# EAGLE schematic backplane (EAGLE 7.6.0)
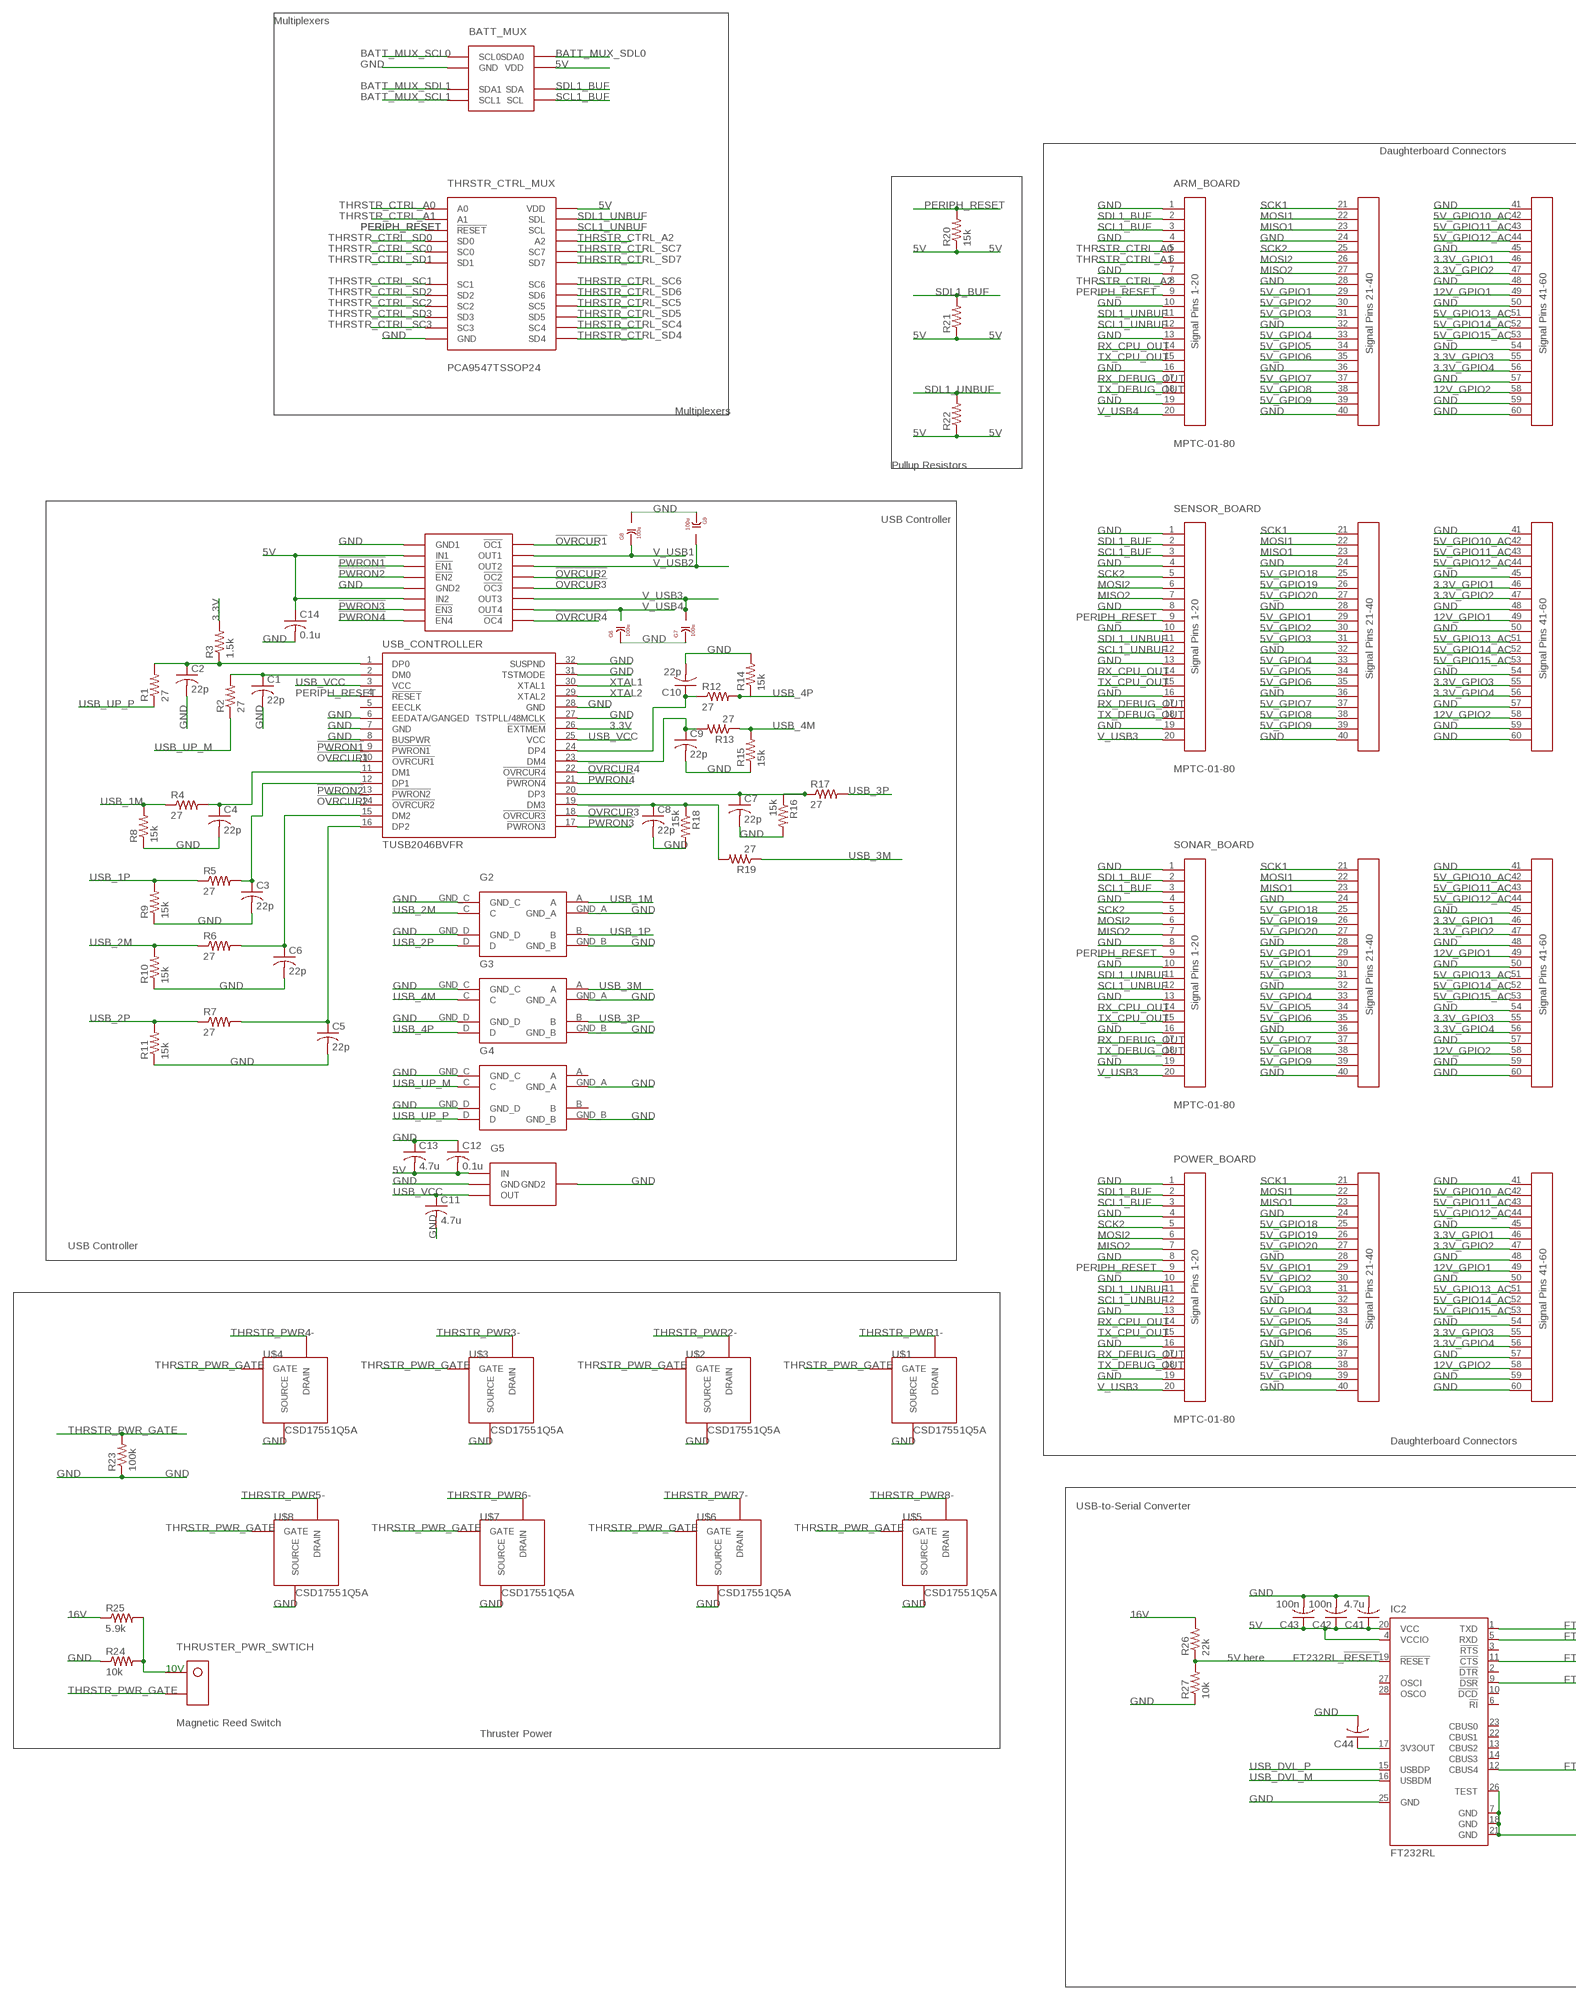
[diagram p0: schematic, sheet 1, part 1 of 2]
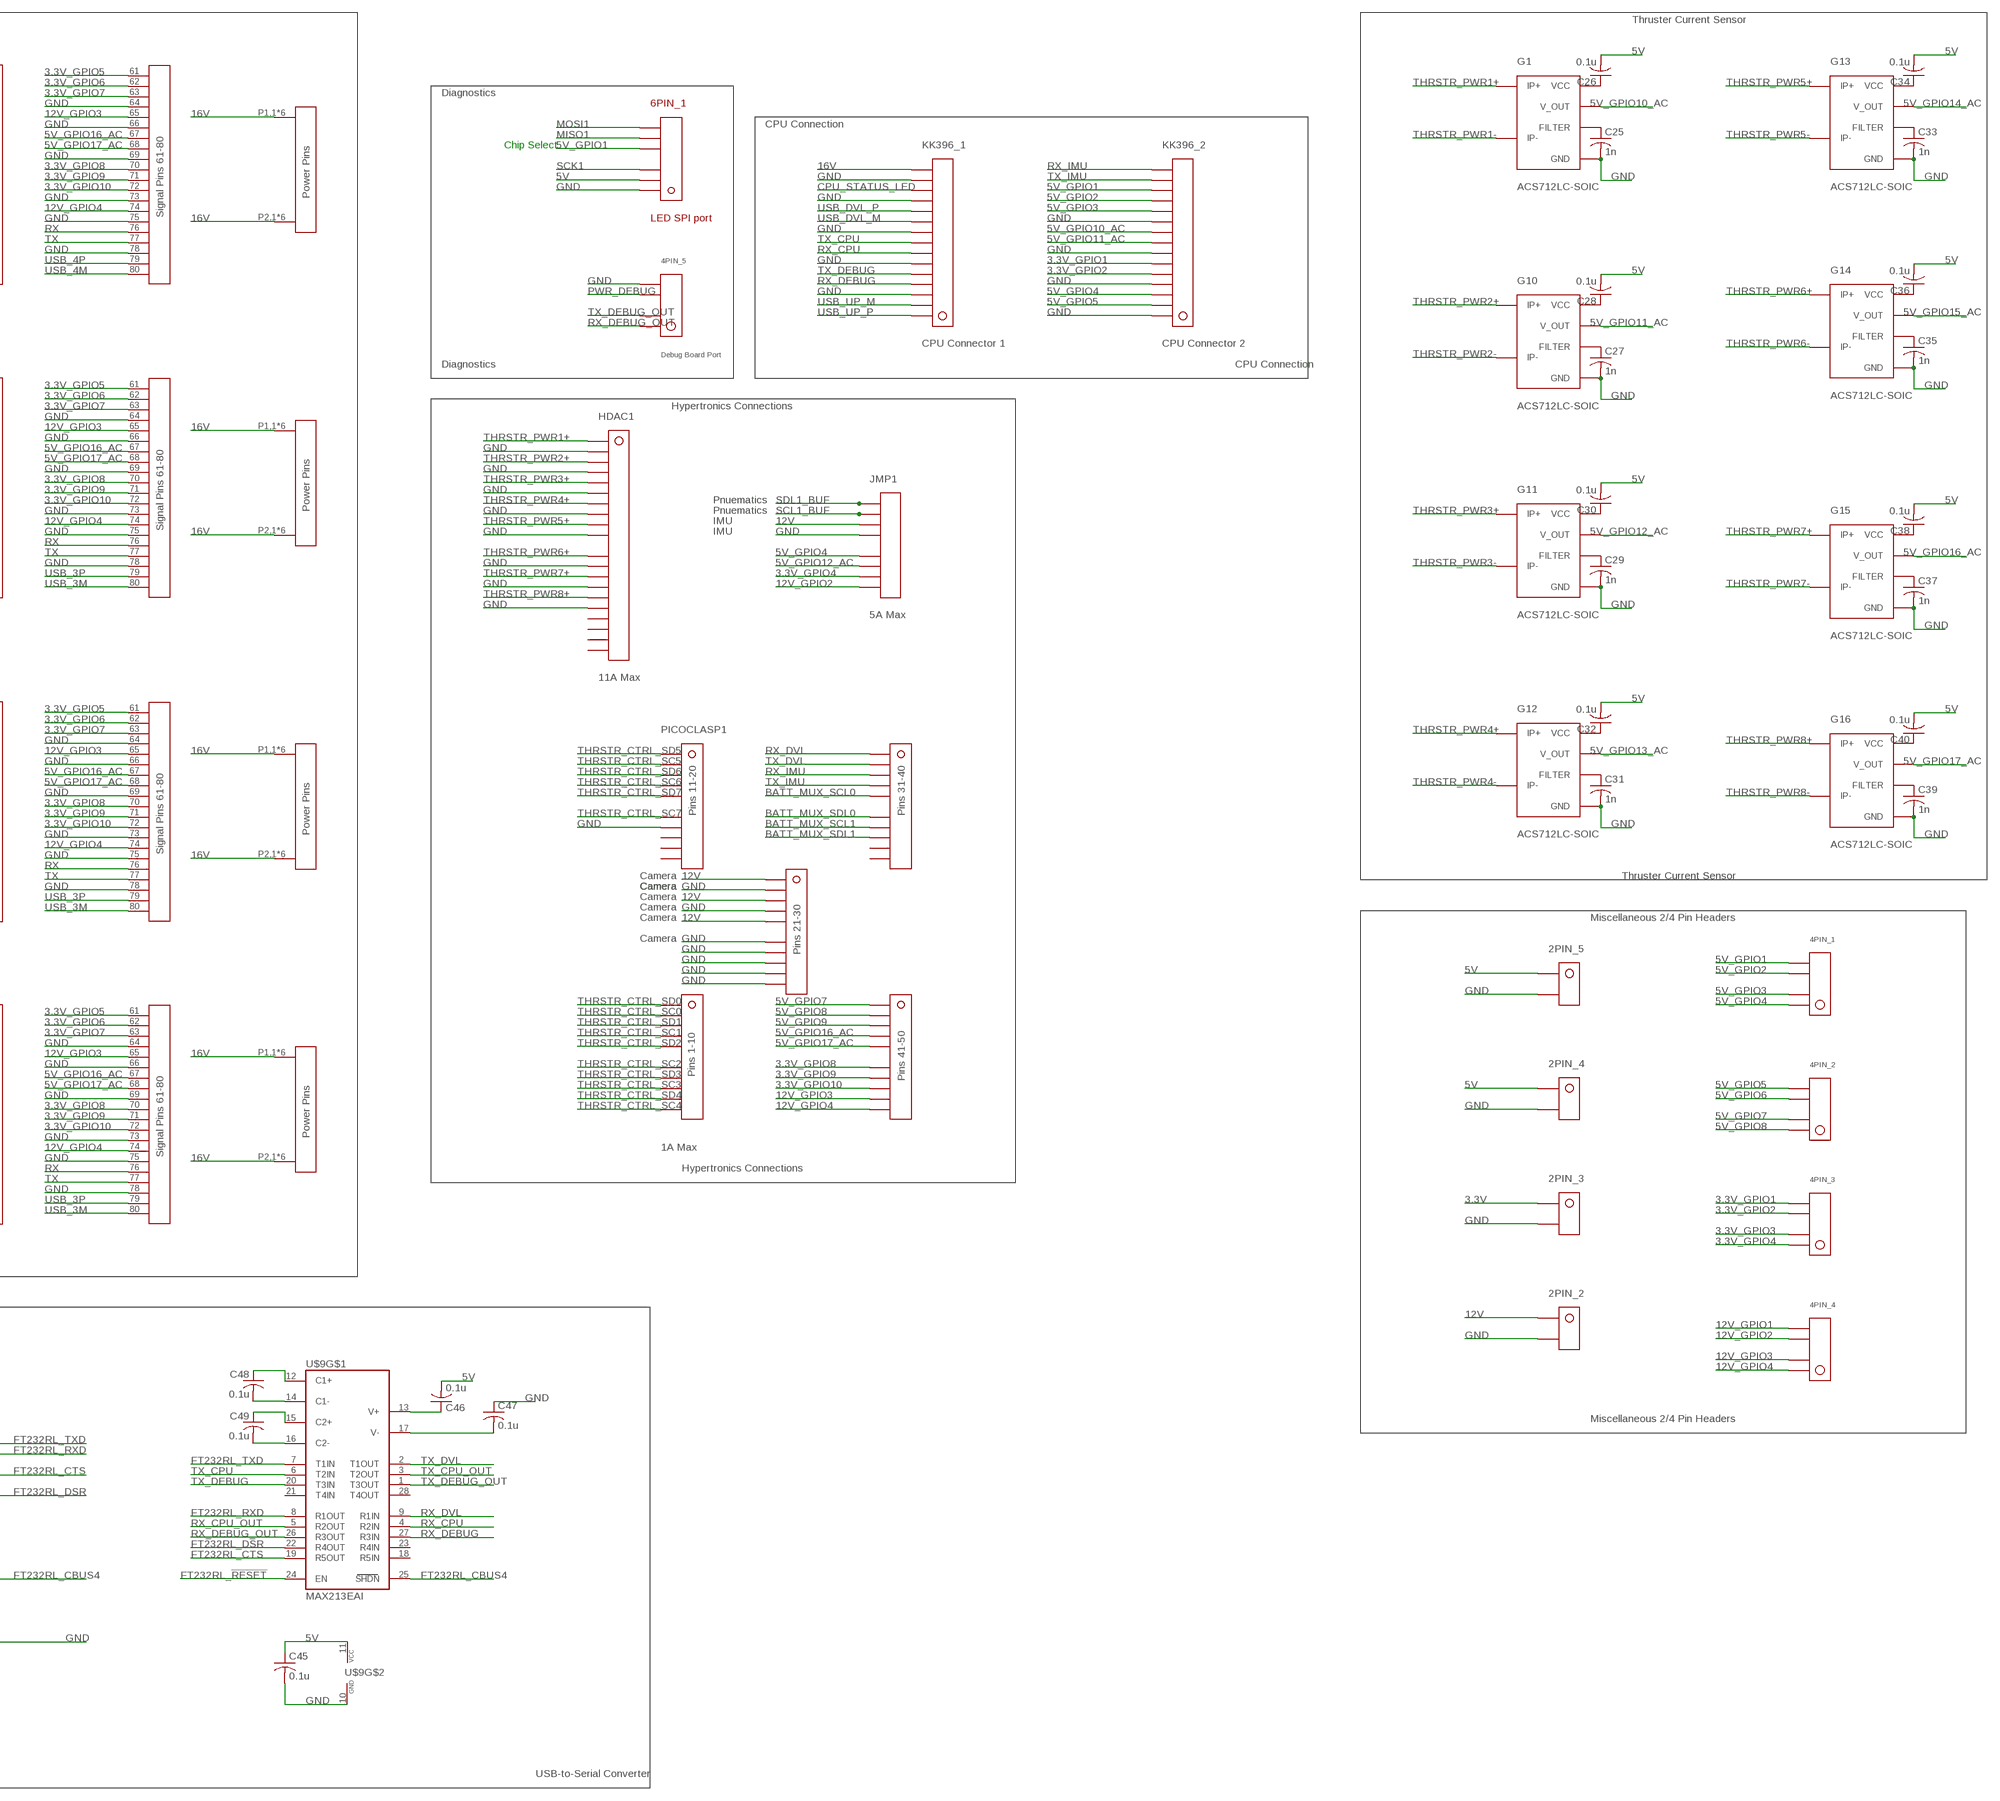
[diagram p1: schematic, sheet 1, part 2 of 2]

## Parts
2PIN_2  KK254_VERT_2PIN22-29-2021  [KK254_VERT_2PIN]
2PIN_3  KK254_VERT_2PIN22-29-2021  [KK254_VERT_2PIN]
2PIN_4  KK254_VERT_2PIN22-29-2021  [KK254_VERT_2PIN]
2PIN_5  KK254_VERT_2PIN22-29-2021  [KK254_VERT_2PIN]
4PIN_1  KK254_VERT_4PIN22-29-2041  [KK254_VERT_4PIN]
4PIN_2  KK254_VERT_4PIN22-29-2041  [KK254_VERT_4PIN]
4PIN_3  KK254_VERT_4PIN22-29-2041  [KK254_VERT_4PIN]
4PIN_4  KK254_VERT_4PIN22-29-2041  [KK254_VERT_4PIN]
4PIN_5  Debug Board Port  KK254_VERT_4PIN22-29-2041  [KK254_VERT_4PIN]
6PIN_1  LED SPI port  KK254_6PIN  [KK254_6PIN]
ARM_BOARD  MPTC-01-80  [MPTC-01-80]
BATT_MUX  PCA9540BTSSOP8  [PCA9540B]
C1  22p  C-USC0603  [C0603]
C2  22p  C-USC0603  [C0603]
C3  22p  C-USC0603  [C0603]
C4  22p  C-USC0603  [C0603]
C5  22p  C-USC0603  [C0603]
C6  22p  C-USC0603  [C0603]
C7  22p  C-USC0603  [C0603]
C8  22p  C-USC0603  [C0603]
C9  22p  C-USC0603  [C0603]
C10  22p  C-USC0603  [C0603]
C11  4.7u  C-USC0603  [C0603]
C12  0.1u  C-USC0603  [C0603]
C13  4.7u  C-USC0603  [C0603]
C14  0.1u  C-USC0603  [C0603]
C25  1n  C-USC0603  [C0603]
C26  0.1u  C-USC0603  [C0603]
C27  1n  C-USC0603  [C0603]
C28  0.1u  C-USC0603  [C0603]
C29  1n  C-USC0603  [C0603]
C30  0.1u  C-USC0603  [C0603]
C31  1n  C-USC0603  [C0603]
C32  0.1u  C-USC0603  [C0603]
C33  1n  C-USC0603  [C0603]
C34  0.1u  C-USC0603  [C0603]
C35  1n  C-USC0603  [C0603]
C36  0.1u  C-USC0603  [C0603]
C37  1n  C-USC0603  [C0603]
C38  0.1u  C-USC0603  [C0603]
C39  1n  C-USC0603  [C0603]
C40  0.1u  C-USC0603  [C0603]
C41  4.7u  C-USC0603  [C0603]
C42  100n  C-USC0603  [C0603]
C43  100n  C-USC0603  [C0603]
C44  C-USC0603  [C0603]
C45  0.1u  C-USC0603  [C0603]
C46  0.1u  C-USC0603  [C0603]
C47  0.1u  C-USC0603  [C0603]
C48  0.1u  C-USC0603  [C0603]
C49  0.1u  C-USC0603  [C0603]
G1  ACS712LC-SOIC  [ACS712-SOIC]
G2  SN75240PW'TSSOP  [SN75240PW]
G3  SN75240PW'TSSOP  [SN75240PW]
G4  SN75240PW'TSSOP  [SN75240PW]
G5  LM3940IMP-3.3/NOPB  [SOT223-DCY]
G6  100u  F930J107MBA  [F930J107MBA]
G7  100u  F930J107MBA  [F930J107MBA]
G8  100u  F930J107MBA  [F930J107MBA]
G9  100u  F930J107MBA  [F930J107MBA]
G10  ACS712LC-SOIC  [ACS712-SOIC]
G11  ACS712LC-SOIC  [ACS712-SOIC]
G12  ACS712LC-SOIC  [ACS712-SOIC]
G13  ACS712LC-SOIC  [ACS712-SOIC]
G14  ACS712LC-SOIC  [ACS712-SOIC]
G15  ACS712LC-SOIC  [ACS712-SOIC]
G16  ACS712LC-SOIC  [ACS712-SOIC]
HDAC1  11A Max  HDAC64_VERT_20PIN30700-4122  [HDAC64_VERT_20PIN]
IC2  FT232RL  [SSOP28]
JMP1  5A Max  MICROFIT3_VERT_8PIN43045-0828  [MICROFIT3_VERT_8PIN]
KK396_1  CPU Connector 1  KK396_VERT_15PIN  [KK396_VERT_15PIN]
KK396_2  CPU Connector 2  KK396_VERT_15PIN  [KK396_VERT_15PIN]
PICOCLASP1  1A Max  PICOCLASP_VERT_50PINSMD  [PICOCLASP_VERT_50PIN]
POWER_BOARD  MPTC-01-80  [MPTC-01-80]
R1  27  R-US_R0603  [R0603]
R2  27  R-US_R0603  [R0603]
R3  1.5k  R-US_R0603  [R0603]
R4  27  R-US_R0603  [R0603]
R5  27  R-US_R0603  [R0603]
R6  27  R-US_R0603  [R0603]
R7  27  R-US_R0603  [R0603]
R8  15k  R-US_R0603  [R0603]
R9  15k  R-US_R0603  [R0603]
R10  15k  R-US_R0603  [R0603]
R11  15k  R-US_R0603  [R0603]
R12  27  R-US_R0603  [R0603]
R13  27  R-US_R0603  [R0603]
R14  15k  R-US_R0603  [R0603]
R15  15k  R-US_R0603  [R0603]
R16  15k  R-US_R0603  [R0603]
R17  27  R-US_R0603  [R0603]
R18  15k  R-US_R0603  [R0603]
R19  27  R-US_R0603  [R0603]
R20  15k  R-US_R0603  [R0603]
R21  R-US_R0603  [R0603]
R22  R-US_R0603  [R0603]
R23  100k  R-US_R0603  [R0603]
R24  10k  R-US_R0603  [R0603]
R25  5.9k  R-US_R0603  [R0603]
R26  22k  R-US_R0603  [R0603]
R27  10k  R-US_R0603  [R0603]
SENSOR_BOARD  MPTC-01-80  [MPTC-01-80]
SONAR_BOARD  MPTC-01-80  [MPTC-01-80]
THRSTR_CTRL_MUX  PCA9547TSSOP24  [PCA9547_TSSOP24]
THRUSTER_PWR_SWTICH  Magnetic Reed Switch  KK254_VERT_2PIN22-29-2021  [KK254_VERT_2PIN]
U$1  CSD17551Q5A  [CSD17551Q5A]
U$2  CSD17551Q5A  [CSD17551Q5A]
U$3  CSD17551Q5A  [CSD17551Q5A]
U$4  CSD17551Q5A  [CSD17551Q5A]
U$5  CSD17551Q5A  [CSD17551Q5A]
U$6  CSD17551Q5A  [CSD17551Q5A]
U$7  CSD17551Q5A  [CSD17551Q5A]
U$8  CSD17551Q5A  [CSD17551Q5A]
U$9  MAX213EAI  [SSOP28]
USB_CONTROLLER  TUSB2046BVFR  [VF_S-PQFP-G32]
USB_CURRENT  TPS2044BBD-SOIC  [TPS2044]

## Nets
3.3V: 2PIN_3.P$1 R3.2 USB_CONTROLLER.26(!EXTMEM)
3.3V_GPIO1: 4PIN_3.P$4 ARM_BOARD.46 KK396_2.P$6 POWER_BOARD.46 SENSOR_BOARD.46 SONAR_BOARD.46
3.3V_GPIO2: 4PIN_3.P$3 ARM_BOARD.47 KK396_2.P$5 POWER_BOARD.47 SENSOR_BOARD.47 SONAR_BOARD.47
3.3V_GPIO3: 4PIN_3.P$2 ARM_BOARD.55 POWER_BOARD.55 SENSOR_BOARD.55 SONAR_BOARD.55
3.3V_GPIO4: 4PIN_3.P$1 ARM_BOARD.56 JMP1.P$2 POWER_BOARD.56 SENSOR_BOARD.56 SONAR_BOARD.56
3.3V_GPIO5: ARM_BOARD.61 POWER_BOARD.61 SENSOR_BOARD.61 SONAR_BOARD.61
3.3V_GPIO6: ARM_BOARD.62 POWER_BOARD.62 SENSOR_BOARD.62 SONAR_BOARD.62
3.3V_GPIO7: ARM_BOARD.63 POWER_BOARD.63 SENSOR_BOARD.63 SONAR_BOARD.63
3.3V_GPIO8: ARM_BOARD.70 PICOCLASP1.P$46 POWER_BOARD.70 SENSOR_BOARD.70 SONAR_BOARD.70
3.3V_GPIO9: ARM_BOARD.71 PICOCLASP1.P$47 POWER_BOARD.71 SENSOR_BOARD.71 SONAR_BOARD.71
3.3V_GPIO10: ARM_BOARD.72 PICOCLASP1.P$48 POWER_BOARD.72 SENSOR_BOARD.72 SONAR_BOARD.72
5V: 2PIN_4.P$1 2PIN_5.P$1 6PIN_1.P$2 BATT_MUX.VDD C12.2 C13.2 C14.1 C26.2 C28.2 C30.2 C32.2 C34.2 C36.2 C38.2 C40.2 C41.1 C42.1 C43.1 C45.1 C46.2 G5.1(IN) IC2.4(VCCIO) IC2.20(VCC) R20.1 R21.1 R22.1 THRSTR_CTRL_MUX.24(VDD) U$9.11(VCC) USB_CURRENT.IN1 USB_CURRENT.IN2
5V_GPIO1: 4PIN_1.P$4 6PIN_1.P$4 ARM_BOARD.29 KK396_2.P$13 POWER_BOARD.29 SENSOR_BOARD.29 SONAR_BOARD.29
5V_GPIO2: 4PIN_1.P$3 ARM_BOARD.30 KK396_2.P$12 POWER_BOARD.30 SENSOR_BOARD.30 SONAR_BOARD.30
5V_GPIO3: 4PIN_1.P$2 ARM_BOARD.31 KK396_2.P$11 POWER_BOARD.31 SENSOR_BOARD.31 SONAR_BOARD.31
5V_GPIO4: 4PIN_1.P$1 ARM_BOARD.33 JMP1.P$4 KK396_2.P$3 POWER_BOARD.33 SENSOR_BOARD.33 SONAR_BOARD.33
5V_GPIO5: 4PIN_2.P$4 ARM_BOARD.34 KK396_2.P$2 POWER_BOARD.34 SENSOR_BOARD.34 SONAR_BOARD.34
5V_GPIO6: 4PIN_2.P$3 ARM_BOARD.35 POWER_BOARD.35 SENSOR_BOARD.35 SONAR_BOARD.35
5V_GPIO7: 4PIN_2.P$2 ARM_BOARD.37 PICOCLASP1.P$41 POWER_BOARD.37 SENSOR_BOARD.37 SONAR_BOARD.37
5V_GPIO8: 4PIN_2.P$1 ARM_BOARD.38 PICOCLASP1.P$42 POWER_BOARD.38 SENSOR_BOARD.38 SONAR_BOARD.38
5V_GPIO9: ARM_BOARD.39 PICOCLASP1.P$43 POWER_BOARD.39 SENSOR_BOARD.39 SONAR_BOARD.39
5V_GPIO10_AC: ARM_BOARD.42 G1.V_OUT KK396_2.P$9 POWER_BOARD.42 SENSOR_BOARD.42 SONAR_BOARD.42
5V_GPIO11_AC: ARM_BOARD.43 G10.V_OUT KK396_2.P$8 POWER_BOARD.43 SENSOR_BOARD.43 SONAR_BOARD.43
5V_GPIO12_AC: ARM_BOARD.44 G11.V_OUT JMP1.P$3 POWER_BOARD.44 SENSOR_BOARD.44 SONAR_BOARD.44
5V_GPIO13_AC: ARM_BOARD.51 G12.V_OUT POWER_BOARD.51 SENSOR_BOARD.51 SONAR_BOARD.51
5V_GPIO14_AC: ARM_BOARD.52 G13.V_OUT POWER_BOARD.52 SENSOR_BOARD.52 SONAR_BOARD.52
5V_GPIO15_AC: ARM_BOARD.53 G14.V_OUT POWER_BOARD.53 SENSOR_BOARD.53 SONAR_BOARD.53
5V_GPIO16_AC: ARM_BOARD.67 G15.V_OUT PICOCLASP1.P$44 POWER_BOARD.67 SENSOR_BOARD.67 SONAR_BOARD.67
5V_GPIO17_AC: ARM_BOARD.68 G16.V_OUT PICOCLASP1.P$45 POWER_BOARD.68 SENSOR_BOARD.68 SONAR_BOARD.68
5V_GPIO18: POWER_BOARD.25 SENSOR_BOARD.25 SONAR_BOARD.25
5V_GPIO19: POWER_BOARD.26 SENSOR_BOARD.26 SONAR_BOARD.26
5V_GPIO20: POWER_BOARD.27 SENSOR_BOARD.27 SONAR_BOARD.27
12V: 2PIN_2.P$1 JMP1.P$6 PICOCLASP1.P$21 PICOCLASP1.P$23 PICOCLASP1.P$25
12V_GPIO1: 4PIN_4.P$4 ARM_BOARD.49 POWER_BOARD.49 SENSOR_BOARD.49 SONAR_BOARD.49
12V_GPIO2: 4PIN_4.P$3 ARM_BOARD.58 JMP1.P$1 POWER_BOARD.58 SENSOR_BOARD.58 SONAR_BOARD.58
12V_GPIO3: 4PIN_4.P$2 ARM_BOARD.65 PICOCLASP1.P$49 POWER_BOARD.65 SENSOR_BOARD.65 SONAR_BOARD.65
12V_GPIO4: 4PIN_4.P$1 ARM_BOARD.74 PICOCLASP1.P$50 POWER_BOARD.74 SENSOR_BOARD.74 SONAR_BOARD.74
16V: ARM_BOARD.P1,1(POWER1) ARM_BOARD.P1,2(POWER1) ARM_BOARD.P1,3(POWER1) ARM_BOARD.P1,4(POWER1) ARM_BOARD.P1,5(POWER1) ARM_BOARD.P1,6(POWER1) ARM_BOARD.P2,1(POWER2) ARM_BOARD.P2,2(POWER2) ARM_BOARD.P2,3(POWER2) ARM_BOARD.P2,4(POWER2) ARM_BOARD.P2,5(POWER2) ARM_BOARD.P2,6(POWER2) KK396_1.P$15 POWER_BOARD.P1,1(POWER1) POWER_BOARD.P1,2(POWER1) POWER_BOARD.P1,3(POWER1) POWER_BOARD.P1,4(POWER1) POWER_BOARD.P1,5(POWER1) POWER_BOARD.P1,6(POWER1) POWER_BOARD.P2,1(POWER2) POWER_BOARD.P2,2(POWER2) POWER_BOARD.P2,3(POWER2) POWER_BOARD.P2,4(POWER2) POWER_BOARD.P2,5(POWER2) POWER_BOARD.P2,6(POWER2) R25.1 R26.2 SENSOR_BOARD.P1,1(POWER1) SENSOR_BOARD.P1,2(POWER1) SENSOR_BOARD.P1,3(POWER1) SENSOR_BOARD.P1,4(POWER1) SENSOR_BOARD.P1,5(POWER1) SENSOR_BOARD.P1,6(POWER1) SENSOR_BOARD.P2,1(POWER2) SENSOR_BOARD.P2,2(POWER2) SENSOR_BOARD.P2,3(POWER2) SENSOR_BOARD.P2,4(POWER2) SENSOR_BOARD.P2,5(POWER2) SENSOR_BOARD.P2,6(POWER2) SONAR_BOARD.P1,1(POWER1) SONAR_BOARD.P1,2(POWER1) SONAR_BOARD.P1,3(POWER1) SONAR_BOARD.P1,4(POWER1) SONAR_BOARD.P1,5(POWER1) SONAR_BOARD.P1,6(POWER1) SONAR_BOARD.P2,1(POWER2) SONAR_BOARD.P2,2(POWER2) SONAR_BOARD.P2,3(POWER2) SONAR_BOARD.P2,4(POWER2) SONAR_BOARD.P2,5(POWER2) SONAR_BOARD.P2,6(POWER2)
!OVRCUR1!: USB_CONTROLLER.10(!OVRCUR1) USB_CURRENT.!OC1!
!OVRCUR2!: USB_CONTROLLER.14(!OVRCUR2) USB_CURRENT.!OC2!
!OVRCUR3!: USB_CONTROLLER.18(!OVRCUR3) USB_CURRENT.!OC3!
!OVRCUR4!: USB_CONTROLLER.22(!OVRCUR4) USB_CURRENT.!OC4!
!PWRON1!: USB_CONTROLLER.9(!PWRON1) USB_CURRENT.!EN1!
!PWRON2!: USB_CONTROLLER.13(!PWRON2) USB_CURRENT.!EN2!
!PWRON3!: USB_CONTROLLER.17(!PWRON3) USB_CURRENT.!EN3!
!PWRON4!: USB_CONTROLLER.21(!PWRON4) USB_CURRENT.!EN4!
BATT_MUX_SCL0: BATT_MUX.SCL0 PICOCLASP1.P$35
BATT_MUX_SCL1: BATT_MUX.SCL1 PICOCLASP1.P$37
BATT_MUX_SDL0: BATT_MUX.SDA0 PICOCLASP1.P$36
BATT_MUX_SDL1: BATT_MUX.SDA1 PICOCLASP1.P$38
CPU_STATUS_LED: KK396_1.P$13
FT232RL_!RESET!: IC2.19(!RESET) R26.1 R27.2 U$9.24(EN)
FT232RL_CBUS4: IC2.12(CBUS4) U$9.25(SHDN)
FT232RL_CTS: IC2.11(!CTS) U$9.19(R5OUT)
FT232RL_DSR: IC2.9(!DSR) U$9.22(R4OUT)
FT232RL_RXD: IC2.5(RXD) U$9.8(R1OUT)
FT232RL_TXD: IC2.1(TXD) U$9.7(T1IN)
GND: 2PIN_2.P$2 2PIN_3.P$2 2PIN_4.P$2 2PIN_5.P$2 4PIN_5.P$4 6PIN_1.P$1 ARM_BOARD.1 ARM_BOARD.4 ARM_BOARD.7 ARM_BOARD.10 ARM_BOARD.13 ARM_BOARD.16 ARM_BOARD.19 ARM_BOARD.24 ARM_BOARD.28 ARM_BOARD.32 ARM_BOARD.36 ARM_BOARD.40 ARM_BOARD.41 ARM_BOARD.45 ARM_BOARD.48 ARM_BOARD.50 ARM_BOARD.54 ARM_BOARD.57 ARM_BOARD.59 ARM_BOARD.60 ARM_BOARD.64 ARM_BOARD.66 ARM_BOARD.69 ARM_BOARD.73 ARM_BOARD.75 ARM_BOARD.78 BATT_MUX.GND C1.2 C2.2 C3.2 C4.2 C5.2 C6.2 C7.2 C8.2 C9.2 C10.2 C11.2 C12.1 C13.1 C14.2 C25.2 C27.2 C29.2 C31.2 C33.2 C35.2 C37.2 C39.2 C41.2 C42.2 C43.2 C44.2 C45.2 C47.1 G1.GND G2.GND_A G2.GND_B G2.GND_C G2.GND_D G3.GND_A G3.GND_B G3.GND_C G3.GND_D G4.GND_A G4.GND_B G4.GND_C G4.GND_D G5.2(GND) G5.TAB(GND2) G6.- G7.- G8.+ G9.- G10.GND G11.GND G12.GND G13.GND G14.GND G15.GND G16.GND HDAC1.P$2 HDAC1.P$4 HDAC1.P$6 HDAC1.P$8 HDAC1.P$10 HDAC1.P$12 HDAC1.P$14 HDAC1.P$16 IC2.7(GND) IC2.18(GND) IC2.21(GND) IC2.25(GND) IC2.26(TEST) JMP1.P$5 KK396_1.P$3 KK396_1.P$6 KK396_1.P$9 KK396_1.P$12 KK396_1.P$14 KK396_2.P$1 KK396_2.P$4 KK396_2.P$7 KK396_2.P$10 PICOCLASP1.P$17 PICOCLASP1.P$22 PICOCLASP1.P$24 PICOCLASP1.P$26 PICOCLASP1.P$27 PICOCLASP1.P$28 PICOCLASP1.P$29 PICOCLASP1.P$30 POWER_BOARD.1 POWER_BOARD.4 POWER_BOARD.8 POWER_BOARD.10 POWER_BOARD.13 POWER_BOARD.16 POWER_BOARD.19 POWER_BOARD.24 POWER_BOARD.28 POWER_BOARD.32 POWER_BOARD.36 POWER_BOARD.40 POWER_BOARD.41 POWER_BOARD.45 POWER_BOARD.48 POWER_BOARD.50 POWER_BOARD.54 POWER_BOARD.57 POWER_BOARD.59 POWER_BOARD.60 POWER_BOARD.64 POWER_BOARD.66 POWER_BOARD.69 POWER_BOARD.73 POWER_BOARD.75 POWER_BOARD.78 R8.1 R9.1 R10.1 R11.1 R14.2 R15.1 R16.2 R18.2 R23.1 R24.1 R27.1 SENSOR_BOARD.1 SENSOR_BOARD.4 SENSOR_BOARD.8 SENSOR_BOARD.10 SENSOR_BOARD.13 SENSOR_BOARD.16 SENSOR_BOARD.19 SENSOR_BOARD.24 SENSOR_BOARD.28 SENSOR_BOARD.32 SENSOR_BOARD.36 SENSOR_BOARD.40 SENSOR_BOARD.41 SENSOR_BOARD.45 SENSOR_BOARD.48 SENSOR_BOARD.50 SENSOR_BOARD.54 SENSOR_BOARD.57 SENSOR_BOARD.59 SENSOR_BOARD.60 SENSOR_BOARD.64 SENSOR_BOARD.66 SENSOR_BOARD.69 SENSOR_BOARD.73 SENSOR_BOARD.75 SENSOR_BOARD.78 SONAR_BOARD.1 SONAR_BOARD.4 SONAR_BOARD.8 SONAR_BOARD.10 SONAR_BOARD.13 SONAR_BOARD.16 SONAR_BOARD.19 SONAR_BOARD.24 SONAR_BOARD.28 SONAR_BOARD.32 SONAR_BOARD.36 SONAR_BOARD.40 SONAR_BOARD.41 SONAR_BOARD.45 SONAR_BOARD.48 SONAR_BOARD.50 SONAR_BOARD.54 SONAR_BOARD.57 SONAR_BOARD.59 SONAR_BOARD.60 SONAR_BOARD.64 SONAR_BOARD.66 SONAR_BOARD.69 SONAR_BOARD.73 SONAR_BOARD.75 SONAR_BOARD.78 THRSTR_CTRL_MUX.P$12(GND) U$1.P$1(SOURCE) U$1.P$2(SOURCE) U$1.P$3(SOURCE) U$2.P$1(SOURCE) U$2.P$2(SOURCE) U$2.P$3(SOURCE) U$3.P$1(SOURCE) U$3.P$2(SOURCE) U$3.P$3(SOURCE) U$4.P$1(SOURCE) U$4.P$2(SOURCE) U$4.P$3(SOURCE) U$5.P$1(SOURCE) U$5.P$2(SOURCE) U$5.P$3(SOURCE) U$6.P$1(SOURCE) U$6.P$2(SOURCE) U$6.P$3(SOURCE) U$7.P$1(SOURCE) U$7.P$2(SOURCE) U$7.P$3(SOURCE) U$8.P$1(SOURCE) U$8.P$2(SOURCE) U$8.P$3(SOURCE) U$9.10(GND) USB_CONTROLLER.6(EEDATA/GANGED) USB_CONTROLLER.7(GND) USB_CONTROLLER.8(BUSPWR) USB_CONTROLLER.27(TSTPLL/48MCLK) USB_CONTROLLER.28(GND) USB_CONTROLLER.31(TSTMODE) USB_CONTROLLER.32(SUSPND) USB_CURRENT.GND1 USB_CURRENT.GND2
MISO1: 6PIN_1.P$5 ARM_BOARD.23 POWER_BOARD.23 SENSOR_BOARD.23 SONAR_BOARD.23
MISO2: ARM_BOARD.27 POWER_BOARD.7 SENSOR_BOARD.7 SONAR_BOARD.7
MOSI1: 6PIN_1.P$6 ARM_BOARD.22 POWER_BOARD.22 SENSOR_BOARD.22 SONAR_BOARD.22
MOSI2: ARM_BOARD.26 POWER_BOARD.6 SENSOR_BOARD.6 SONAR_BOARD.6
N$1: C2.1 R1.2 R3.1 USB_CONTROLLER.1(DP0)
N$2: C1.1 R2.2 USB_CONTROLLER.2(DM0)
N$3: R24.2 R25.2 THRUSTER_PWR_SWTICH.P$1
N$9: C4.1 R4.2 USB_CONTROLLER.11(DM1)
N$10: C3.1 R5.2 USB_CONTROLLER.12(DP1)
N$13: C6.1 R6.2 USB_CONTROLLER.15(DM2)
N$14: C5.1 R7.2 USB_CONTROLLER.16(DP2)
N$21: C10.1 R12.1 USB_CONTROLLER.24(DP4)
N$22: C9.1 R13.2 USB_CONTROLLER.23(DM4)
N$25: C7.1 R16.1 R17.1 USB_CONTROLLER.20(DP3)
N$26: C8.1 R18.1 R19.2 USB_CONTROLLER.19(DM3)
N$32: C27.1 G10.FILTER
N$33: C46.1 U$9.13(V+)
N$34: C47.2 U$9.17(V-)
N$35: C44.1 IC2.17(3V3OUT)
N$65: C49.2 U$9.16(C2-)
N$66: C49.1 U$9.15(C2+)
N$67: C48.2 U$9.14(C1-)
N$68: C48.1 U$9.12(C1+)
N$81: C28.1 G10.VCC
N$82: C26.1 G1.VCC
N$83: C29.1 G11.FILTER
N$84: C30.1 G11.VCC
N$85: C25.1 G1.FILTER
N$86: C31.1 G12.FILTER
N$87: C32.1 G12.VCC
N$88: C33.1 G13.FILTER
N$89: C34.1 G13.VCC
N$90: C35.1 G14.FILTER
N$91: C36.1 G14.VCC
N$92: C37.1 G15.FILTER
N$93: C38.1 G15.VCC
N$94: C39.1 G16.FILTER
N$95: C40.1 G16.VCC
PERIPH_RESET: ARM_BOARD.9 POWER_BOARD.9 R20.2 SENSOR_BOARD.9 SONAR_BOARD.9 THRSTR_CTRL_MUX.P$3(!RESET) USB_CONTROLLER.4(!RESET)
PWR_DEBUG: 4PIN_5.P$3
RX: ARM_BOARD.76 POWER_BOARD.76 SENSOR_BOARD.76 SONAR_BOARD.76
RX_CPU: KK396_1.P$7 U$9.4(R2IN)
RX_CPU_OUT: ARM_BOARD.14 POWER_BOARD.14 SENSOR_BOARD.14 SONAR_BOARD.14 U$9.5(R2OUT)
RX_DEBUG: KK396_1.P$4 U$9.27(R3IN)
RX_DEBUG_OUT: 4PIN_5.P$1 ARM_BOARD.17 POWER_BOARD.17 SENSOR_BOARD.17 SONAR_BOARD.17 U$9.26(R3OUT)
RX_DVL: PICOCLASP1.P$31 U$9.9(R1IN)
RX_IMU: KK396_2.P$15 PICOCLASP1.P$33
SCK1: 6PIN_1.P$3 ARM_BOARD.21 POWER_BOARD.21 SENSOR_BOARD.21 SONAR_BOARD.21
SCK2: ARM_BOARD.25 POWER_BOARD.5 SENSOR_BOARD.5 SONAR_BOARD.5
SCL1_BUF: ARM_BOARD.3 BATT_MUX.SCL JMP1.P$7 POWER_BOARD.3 SENSOR_BOARD.3 SONAR_BOARD.3
SCL1_UNBUF: ARM_BOARD.12 POWER_BOARD.12 SENSOR_BOARD.12 SONAR_BOARD.12 THRSTR_CTRL_MUX.P$21(SCL)
SDL1_BUF: ARM_BOARD.2 BATT_MUX.SDA JMP1.P$8 POWER_BOARD.2 R21.2 SENSOR_BOARD.2 SONAR_BOARD.2
SDL1_UNBUF: ARM_BOARD.11 POWER_BOARD.11 R22.2 SENSOR_BOARD.11 SONAR_BOARD.11 THRSTR_CTRL_MUX.P$22(SDL)
THRSTR_CTRL_A0: ARM_BOARD.5 THRSTR_CTRL_MUX.P$1(A0)
THRSTR_CTRL_A1: ARM_BOARD.6 THRSTR_CTRL_MUX.P$2(A1)
THRSTR_CTRL_A2: ARM_BOARD.8 THRSTR_CTRL_MUX.P$23(A2)
THRSTR_CTRL_SC0: PICOCLASP1.P$2 THRSTR_CTRL_MUX.P$5(SC0)
THRSTR_CTRL_SC1: PICOCLASP1.P$4 THRSTR_CTRL_MUX.P$7(SC1)
THRSTR_CTRL_SC2: PICOCLASP1.P$6 THRSTR_CTRL_MUX.P$9(SC2)
THRSTR_CTRL_SC3: PICOCLASP1.P$8 THRSTR_CTRL_MUX.P$11(SC3)
THRSTR_CTRL_SC4: PICOCLASP1.P$10 THRSTR_CTRL_MUX.P$14(SC4)
THRSTR_CTRL_SC5: PICOCLASP1.P$12 THRSTR_CTRL_MUX.P$16(SC5)
THRSTR_CTRL_SC6: PICOCLASP1.P$14 THRSTR_CTRL_MUX.P$18(SC6)
THRSTR_CTRL_SC7: PICOCLASP1.P$16 THRSTR_CTRL_MUX.P$20(SC7)
THRSTR_CTRL_SD0: PICOCLASP1.P$1 THRSTR_CTRL_MUX.P$4(SD0)
THRSTR_CTRL_SD1: PICOCLASP1.P$3 THRSTR_CTRL_MUX.P$6(SD1)
THRSTR_CTRL_SD2: PICOCLASP1.P$5 THRSTR_CTRL_MUX.P$8(SD2)
THRSTR_CTRL_SD3: PICOCLASP1.P$7 THRSTR_CTRL_MUX.P$10(SD3)
THRSTR_CTRL_SD4: PICOCLASP1.P$9 THRSTR_CTRL_MUX.P$13(SD4)
THRSTR_CTRL_SD5: PICOCLASP1.P$11 THRSTR_CTRL_MUX.P$15(SD5)
THRSTR_CTRL_SD6: PICOCLASP1.P$13 THRSTR_CTRL_MUX.P$17(SD6)
THRSTR_CTRL_SD7: PICOCLASP1.P$15 THRSTR_CTRL_MUX.P$19(SD7)
THRSTR_PWR1+: G1.IP+1(IP+) G1.IP+2(IP+) HDAC1.P$1
THRSTR_PWR1-: G1.IP-1(IP-) G1.IP-2(IP-) U$1.P$5(DRAIN) U$1.P$6(DRAIN) U$1.P$7(DRAIN) U$1.P$8(DRAIN)
THRSTR_PWR2+: G10.IP+1(IP+) G10.IP+2(IP+) HDAC1.P$3
THRSTR_PWR2-: G10.IP-1(IP-) G10.IP-2(IP-) U$2.P$5(DRAIN) U$2.P$6(DRAIN) U$2.P$7(DRAIN) U$2.P$8(DRAIN)
THRSTR_PWR3+: G11.IP+1(IP+) G11.IP+2(IP+) HDAC1.P$5
THRSTR_PWR3-: G11.IP-1(IP-) G11.IP-2(IP-) U$3.P$5(DRAIN) U$3.P$6(DRAIN) U$3.P$7(DRAIN) U$3.P$8(DRAIN)
THRSTR_PWR4+: G12.IP+1(IP+) G12.IP+2(IP+) HDAC1.P$7
THRSTR_PWR4-: G12.IP-1(IP-) G12.IP-2(IP-) U$4.P$5(DRAIN) U$4.P$6(DRAIN) U$4.P$7(DRAIN) U$4.P$8(DRAIN)
THRSTR_PWR5+: G13.IP+1(IP+) G13.IP+2(IP+) HDAC1.P$9
THRSTR_PWR5-: G13.IP-1(IP-) G13.IP-2(IP-) U$8.P$5(DRAIN) U$8.P$6(DRAIN) U$8.P$7(DRAIN) U$8.P$8(DRAIN)
THRSTR_PWR6+: G14.IP+1(IP+) G14.IP+2(IP+) HDAC1.P$11
THRSTR_PWR6-: G14.IP-1(IP-) G14.IP-2(IP-) U$7.P$5(DRAIN) U$7.P$6(DRAIN) U$7.P$7(DRAIN) U$7.P$8(DRAIN)
THRSTR_PWR7+: G15.IP+1(IP+) G15.IP+2(IP+) HDAC1.P$13
THRSTR_PWR7-: G15.IP-1(IP-) G15.IP-2(IP-) U$6.P$5(DRAIN) U$6.P$6(DRAIN) U$6.P$7(DRAIN) U$6.P$8(DRAIN)
THRSTR_PWR8+: G16.IP+1(IP+) G16.IP+2(IP+) HDAC1.P$15
THRSTR_PWR8-: G16.IP-1(IP-) G16.IP-2(IP-) U$5.P$5(DRAIN) U$5.P$6(DRAIN) U$5.P$7(DRAIN) U$5.P$8(DRAIN)
THRSTR_PWR_GATE: R23.2 THRUSTER_PWR_SWTICH.P$2 U$1.P$4(GATE) U$2.P$4(GATE) U$3.P$4(GATE) U$4.P$4(GATE) U$5.P$4(GATE) U$6.P$4(GATE) U$7.P$4(GATE) U$8.P$4(GATE)
TX: ARM_BOARD.77 POWER_BOARD.77 SENSOR_BOARD.77 SONAR_BOARD.77
TX_CPU: KK396_1.P$8 U$9.6(T2IN)
TX_CPU_OUT: ARM_BOARD.15 POWER_BOARD.15 SENSOR_BOARD.15 SONAR_BOARD.15 U$9.3(T2OUT)
TX_DEBUG: KK396_1.P$5 U$9.20(T3IN)
TX_DEBUG_OUT: 4PIN_5.P$2 ARM_BOARD.18 POWER_BOARD.18 SENSOR_BOARD.18 SONAR_BOARD.18 U$9.1(T3OUT)
TX_DVL: PICOCLASP1.P$32 U$9.2(T1OUT)
TX_IMU: KK396_2.P$14 PICOCLASP1.P$34
USB_1M: G2.A R4.1 R8.2
USB_1P: G2.B R5.1 R9.2
USB_2M: G2.C R6.1 R10.2
USB_2P: G2.D R7.1 R11.2
USB_3M: G3.A POWER_BOARD.80 R19.1 SENSOR_BOARD.80 SONAR_BOARD.80
USB_3P: G3.B POWER_BOARD.79 R17.2 SENSOR_BOARD.79 SONAR_BOARD.79
USB_4M: ARM_BOARD.80 G3.C R13.1 R15.2
USB_4P: ARM_BOARD.79 G3.D R12.2 R14.1
USB_DVL_M: IC2.16(USBDM) KK396_1.P$10
USB_DVL_P: IC2.15(USBDP) KK396_1.P$11
USB_UP_M: G4.C KK396_1.P$2 R2.1
USB_UP_P: G4.D KK396_1.P$1 R1.1
USB_VCC: C11.1 G5.3(OUT) USB_CONTROLLER.3(VCC) USB_CONTROLLER.25(VCC)
V_USB1: G8.- USB_CURRENT.OUT1
V_USB2: G9.+ USB_CURRENT.OUT2
V_USB3: G7.+ POWER_BOARD.20 SENSOR_BOARD.20 SONAR_BOARD.20 USB_CURRENT.OUT3
V_USB4: ARM_BOARD.20 G6.+ USB_CURRENT.OUT4
XTAL1: USB_CONTROLLER.30(XTAL1)
XTAL2: USB_CONTROLLER.29(XTAL2)
Unconnected: G4.A G4.B HDAC1.P$17 HDAC1.P$18 HDAC1.P$19 HDAC1.P$20 IC2.2(!DTR) IC2.3(!RTS) IC2.6(!RI) IC2.10(!DCD) IC2.13(CBUS2) IC2.14(CBUS3) IC2.22(CBUS1) IC2.23(CBUS0) IC2.27(OSCI) IC2.28(OSCO) PICOCLASP1.P$18 PICOCLASP1.P$19 PICOCLASP1.P$20 PICOCLASP1.P$39 PICOCLASP1.P$40 U$9.18(R5IN) U$9.21(T4IN) U$9.23(R4IN) U$9.28(T4OUT) USB_CONTROLLER.5(EECLK)

## Notes on the sheet
- Multiplexers
- Daughterboard Connectors | Thruster Current Sensor
- Diagnostics
- CPU Connection
- Chip Select
- Multiplexers
- Pullup Resistors
- Diagnostics | CPU Connection
- USB Controller
- Hypertronics Connections
- Pnuematics
- Pnuematics
- IMU
- IMU
- Camera | Thruster Current Sensor
- Camera | Camera
- Camera
- Camera
- Camera | Miscellaneous 2/4 Pin Headers
- Camera
- USB Controller
- Hypertronics Connections
- Daughterboard Connectors
- USB-to-Serial Converter
- Miscellaneous 2/4 Pin Headers
- 5V here
- 10V
- Thruster Power
- USB-to-Serial Converter

## Library data of the parts
2PIN_2-2PIN_5 THRUSTER_PWR_SWTICH = molex:KK254_VERT_2PIN: KK® 254 Wire-to-Board Header, Vertical, with Friction Lock, 2 Circuits, Gold (Au) Plating Part Number: 22-29-2021 http://www.molex.com/molex/products/datasheet.jsp?part=active/0022292021_PCB_HEADERS.xml
4PIN_1-4PIN_5 = molex:KK254_VERT_4PIN: KK® 254 Wire-to-Board Header, Vertical, with Friction Lock, 4 Circuits, Gold (Au) Plating Part Number: 22-29-2041 http://www.molex.com/molex/products/datasheet.jsp?part=active/0022292041_PCB_HEADERS.xml
6PIN_1 = molex:KK254_6PIN: Molex KK254 series 6-pin package Datasheet <http://www.molex.com/pdm_docs/sd/022032061_sd.pdf> Link <http://www.molex.com/molex/products/listview.jsp?query=&offset=0&filter=&fs=&npp=20&sType=a&autoNav=&path=+inmeta%3Apromotable%253Dyes+inmeta%3ACollectionName%253DImpulse++inmeta%3Acategory%253DPCB%252520Headers+inmeta%3Abreakaway%253DNo+inmeta%3Acircuitsloaded%253D6%2526partialfields%3D%28productname%3AKK%252520254%29&channel=products>
ARM_BOARD POWER_BOARD SENSOR_BOARD SONAR_BOARD = samtec:MPTC-01-80: Samtec 30A Signal/Power Combo System Part number: MPTC-01-80-01 Datasheet <http://suddendocs.samtec.com/catalog_english/mptc.pdf>, Drawing <http://suddendocs.samtec.com/prints/mptc-xx-xx-xx-6.30-xx-x-v-xx-mkt.pdf>, Footprint <http://suddendocs.samtec.com/prints/mptc-xx-xx-xx-6.30-xx-x-v-xx-footprint.pdf> Created by: Ben Hurwitz Created on: 3 Dec 2015 Project: Backplane Group: Robotics @ Maryland Autonomous Submarine University of Maryland, College Park, MD, USA Description; This is an 82-pin female signal/power combination plug, with 80 5A signal pins and 2 24.7A power blades (each uses six pins). It was designed to be used on a backplane for the autonomous submarine to connect the four main daughterboards to the CPU and batteries via the backplane. It fits with the Samtec MPSC male half.
BATT_MUX = NXP:PCA9540B: NXP PCA9540B-TSSOP8 2-Channel I2C-bus Multiplexer I2C-controlled, 5V supply, 1.8-6.5V outputs, 20mA currents Datasheet <http://www.nxp.com/documents/data_sheet/PCA9540B.pdf> Created by Ben Hurwitz, 9 March 2016
C1-C14 C25-C49 = resistor:C-US: CAPACITOR, American symbol
G1 G10-G16 = allegro:ACS712: Allegro ACS712 Fully Integrated, Hall Effect-Based Linear Current Sensor IC with 2.1 kVRMS Isolation and a Low-Resistance Current Conductor 8-pin SOIC package **Current sensor** Datasheet and Description <http://www.allegromicro.com/en/Products/Current-Sensor-ICs/Zero-To-Fifty-Amp-Integrated-Conductor-Sensor-ICs/ACS712.aspx> Created by Ben Hurwitz Robotics @ Maryland May 10, 2016
G2-G4 = texas:SN75240PW: Texas Instrument SN75240PW TSSOP SMD USB Port Transient Suppressor Datasheet <http://www.ti.com/lit/ds/symlink/sn75240.pdf>
G5 = texas:LM3940: Texas Instruments LM3940 Voltage Regulator 1A Low-Dropout Regulator for 5V to 3.3V Conversion Datasheet <http://www.ti.com/lit/ds/symlink/lm3940.pdf>
G6-G9 = avx:F930J107MBA: AVX Tantalum J-Lead Capacitor F930J107MBA Datasheet <http://datasheets.avx.com/f93.pdf>
HDAC1 = molex:HDAC64_VERT_20PIN: 2.54mm Pitch, H-DAC 64™ High Density Automotive Header, Dual Row, Vertical, 20 Circuits, Polarization Option 1, Gray, Tray Part Number: 30700-4200 Datasheet <http://www.molex.com/molex/products/datasheet.jsp?part=active/0307004200_PCB_HEADERS.xm>
IC2 = ftdichip:FT232R: Source: http://www.ftdichip.com/Documents/DataSheets/DS_FT232R_v104.pdf; MPN: FT232RL; OC_FARNELL: 1146032; OC_NEWARK: 91K9918
JMP1 = molex:MICROFIT3_VERT_8PIN: Micro-Fit 3.0™ Vertical Header, 3.00mm Pitch, Dual Row, 8 Circuits, with PCB Polarizing Peg, Gold, Glow Wire Compliant, Black Part Number: 43045-0828 Link <http://www.molex.com/molex/products/datasheet.jsp?part=active/0430450828_PCB_HEADERS.xml>
KK396_1 KK396_2 = molex:KK396_VERT_15PIN: KK® 396 Header, Vertical, without Peg, 15 Circuits, Gold (Au) Plating Part Number: 26-61-2150 Datasheet <http://www.molex.com/pdm_docs/sd/026612150_sd.pdf> Information <http://www.molex.com/molex/products/datasheet.jsp?part=active/0026612150_PCB_HEADERS.xml> Created by Ben Hurwitz, 10 March 2016
PICOCLASP1 = molex:PICOCLASP_VERT_50PIN: 1.00mm Pitch Pico-Clasp™ Wire-to-Board PCB Header, Dual Row, Vertical, 50 Circuits, with Pick-and-Place Tape Part Number: 501190-5017 http://www.molex.com/molex/products/datasheet.jsp?part=active/5011905017_PCB_HEADERS.xml
R1-R27 = resistor:R-US_: RESISTOR, American symbol
THRSTR_CTRL_MUX = NXP:PCA9547
U$1-U$8 = texas:CSD17551Q5A
U$9 = maxim:MAX213EAI: Maxim Integrated MAX213EAI RS232 Tranceiver SSOP28 package Datasheet <https://datasheets.maximintegrated.com/en/ds/MAX200-MAX213.pdf> Created on 14 June 2016
USB_CONTROLLER = texas:TUSB2046B: 4-PORT HUB FOR THE UNIVERSAL SERIAL BUS WITH OPTIONAL SERIAL EEPROM INTERFACE Auto generated by make-symbol-device-package-bsdl.ulp Rev. 30 Source: http://focus.ti.com/lit/ds/symlink/tusb2046b.pdf; MF: TEXAS INSTRUMENTS; MPN: TUSB2046BVFR; OC_FARNELL: 1470507; OC_NEWARK: 77C1806
USB_CURRENT = texas:TPS2044B: Texas Instruments TPS2044BD-SOIC Current-limited power distribution switches 0.5A continuous current, 1.25A max current, 3.3-5V Datasheet <http://www.ti.com/lit/ds/symlink/tps2044b.pdf> NOTE: These replace the older TPS2044/54 switches.